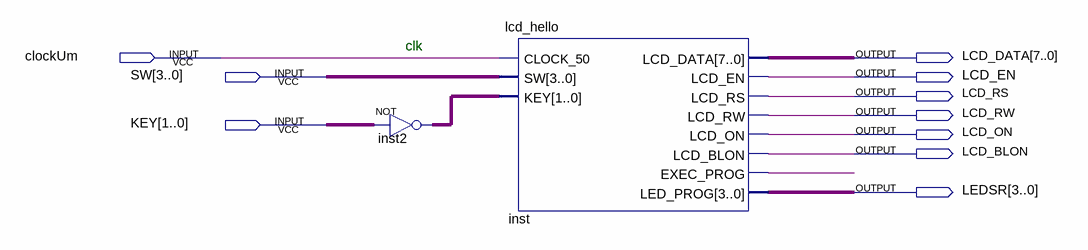
[diagram p0: schematic sheet]
// Quartus schematic Somente_LCD.bdf as structural Verilog: 2 symbols, 10 pins
module Somente_LCD (
  input  clockUm,
  input  [3:0] SW,
  input  [1:0] KEY,
  output [7:0] LCD_DATA,
  output LCD_EN,
  output LCD_RS,
  output LCD_RW,
  output LCD_ON,
  output LCD_BLON,
  output [3:0] LEDSR
);

  wire inst_exec_prog;
  wire [1:0] inst2_out;

  assign inst2_out = ~KEY;  // NOT inst2, 2 bits wide
  lcd_hello inst (
    .CLOCK_50(clockUm), .SW(SW), .KEY(inst2_out), .LCD_DATA(LCD_DATA), .LCD_EN(LCD_EN), .LCD_RS(LCD_RS),
    .LCD_RW(LCD_RW), .LCD_ON(LCD_ON), .LCD_BLON(LCD_BLON), .EXEC_PROG(inst_exec_prog), .LED_PROG(LEDSR));

  // Other names for the same wires on the sheet: clk = clockUm

  // Notes on the sheet:
  //   clk
endmodule
